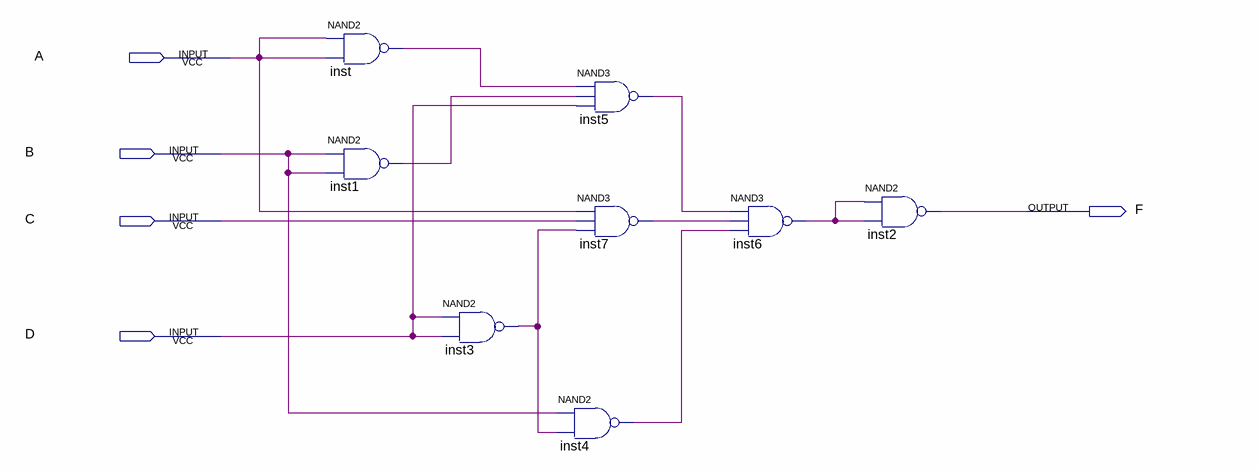
[diagram p0: schematic sheet]
// Quartus schematic LAB2_2.bdf as structural Verilog: 8 symbols, 5 pins
module LAB2_2 (
  input  A,
  input  B,
  input  C,
  input  D,
  output F
);

  wire inst1_out, inst3_out, inst4_out, inst5_out, inst6_out, inst7_out, inst_out;

  nand inst (inst_out, A, A);
  nand inst1 (inst1_out, B, B);
  nand inst3 (inst3_out, D, D);
  nand inst4 (inst4_out, B, inst3_out);
  nand inst5 (inst5_out, inst_out, inst1_out, D);
  nand inst7 (inst7_out, A, C, inst3_out);
  nand inst6 (inst6_out, inst5_out, inst7_out, inst4_out);
  nand inst2 (F, inst6_out, inst6_out);
endmodule
